# EAGLE design STM32L441CE (EAGLE 9.6.2)

## Sheet 1 of 2
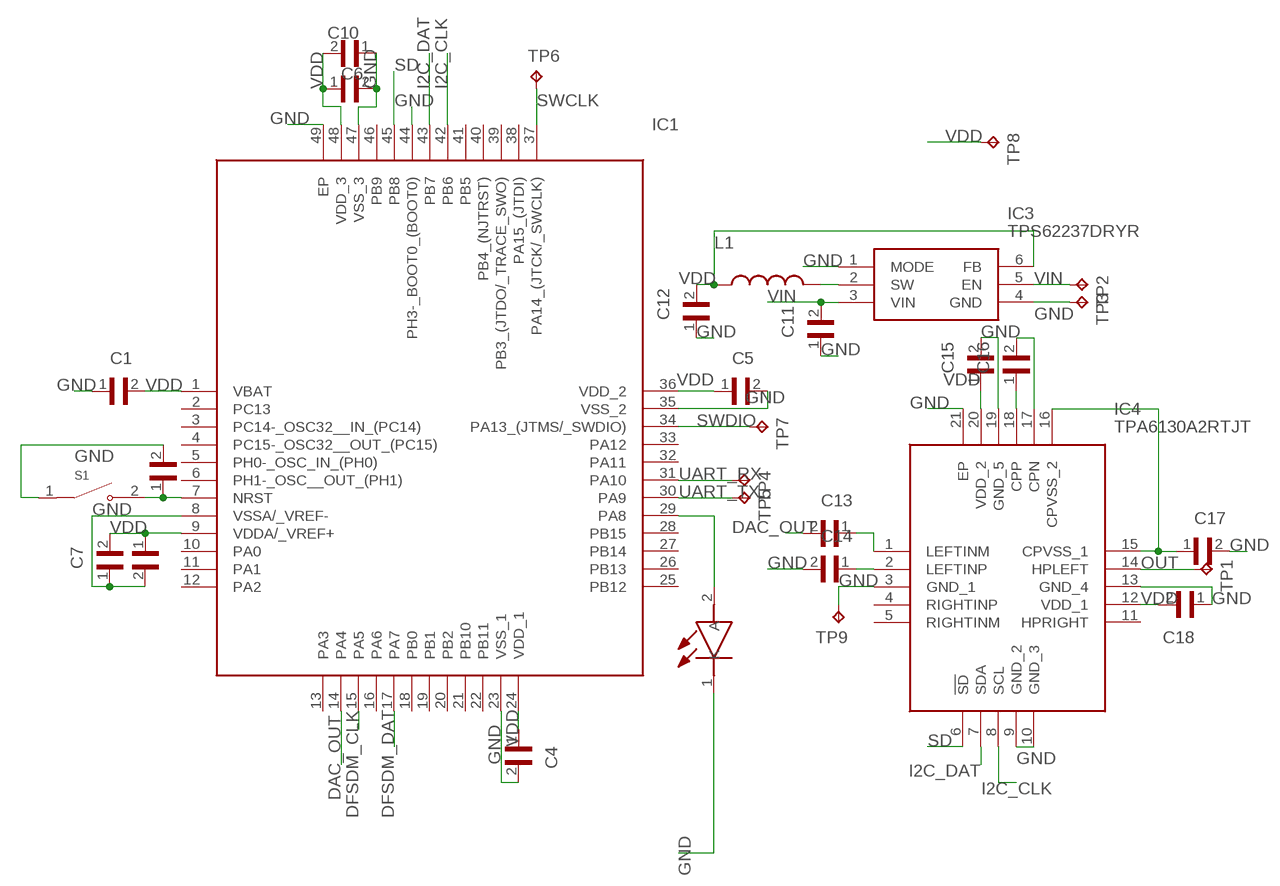
[diagram p0: schematic, sheet 1]

### Parts
C1  GRM033C80J104KE15D  [CAPC0603X33N]
C2  GRM033C80J104KE15D  [CAPC0603X33N]
C3  GRM033C80J104KE15D  [CAPC0603X33N]
C4  GRM033C80J104KE15D  [CAPC0603X33N]
C5  GRM033C80J104KE15D  [CAPC0603X33N]
C6  GRM033C80J104KE15D  [CAPC0603X33N]
C7  JMK105C6105KV-F  [CAPC1005X55N]
C10  GRM155R60J475ME47D  [CAPC1005X60N]
C11  GRM155R60J225KE95D  [CAPC1005X55N]
C12  GRM155R60J475ME47D  [CAPC1005X60N]
C13  CC0402KRX5R5BB474  [CAPC1005X55N]
C14  CC0402KRX5R5BB474  [CAPC1005X55N]
C15  JMK105C6105KV-F  [CAPC1005X55N]
C16  JMK105C6105KV-F  [CAPC1005X55N]
C17  JMK105C6105KV-F  [CAPC1005X55N]
C18  JMK105C6105KV-F  [CAPC1005X55N]
IC1  STM32L451CEU6  [QFN50P700X700X60-49N]
IC3  TPS62237DRYR  [SON50P100X145X60-6N]
IC4  TPA6130A2RTJT  [QFN50P400X400X80-21N]
L1  LQM21PN2R2MC0D  [INDC2012X55N]
LED1  VLMS1500-GS08  [VLMG1500GS08]
S1  B3U-1000P  [SW_B3U-1000P]
TP1  TPTP11R  [TP11R]
TP2  TPTP11R  [TP11R]
TP3  TPTP11R  [TP11R]
TP4  TPTP11R  [TP11R]
TP5  TPTP11R  [TP11R]
TP6  TPTP11R  [TP11R]
TP7  TPTP11R  [TP11R]
TP8  TPTP11R  [TP11R]
TP9  TPTP11R  [TP11R]

### Nets
DAC_OUT: C13.2 IC1.14(PA4)
DFSDM_CLK: IC1.15(PA5) ; also sheet 2
DFSDM_DAT: IC1.17(PA7) ; also sheet 2
GND: C1.1 C2.2 C3.2 C4.2 C5.2 C6.2 C7.1 C10.1 C11.1 C12.1 C14.2 C15.2 C17.2 C18.1 IC1.8(VSSA/_VREF-) IC1.23(VSS_1) IC1.35(VSS_2) IC1.44(PH3-_BOOT0_(BOOT0)) IC1.47(VSS_3) IC1.49(EP) IC3.1(MODE) IC3.4(GND) IC4.3(GND_1) IC4.9(GND_2) IC4.10(GND_3) IC4.13(GND_4) IC4.19(GND_5) IC4.21(EP) LED1.1(K) S1.1 TP3.TP TP9.TP ; also sheet 2
I2C_CLK: IC1.42(PB6) IC4.8(SCL)
I2C_DAT: IC1.43(PB7) IC4.7(SDA)
N$1: C2.1 IC1.7(NRST) S1.2
N$2: IC3.2(SW) L1.2
N$3: C13.1 IC4.1(LEFTINM)
N$4: C14.1 IC4.2(LEFTINP)
N$5: IC1.29(PA8) LED1.2(A)
N$6: C16.1 IC4.18(CPP)
N$7: C16.2 IC4.17(CPN)
N$8: C17.1 IC4.15(CPVSS_1) IC4.16(CPVSS_2)
OUT: IC4.14(HPLEFT) TP1.TP
SD: IC1.45(PB8) IC4.6(!SD)
SWCLK: IC1.37(PA14_(JTCK/_SWCLK)) TP6.TP
SWDIO: IC1.34(PA13_(JTMS/_SWDIO)) TP7.TP
UART_RX: IC1.31(PA10) TP4.TP
UART_TX: IC1.30(PA9) TP5.TP
VDD: C1.2 C3.1 C4.1 C5.1 C6.1 C7.2 C10.2 C12.2 C15.1 C18.2 IC1.1(VBAT) IC1.9(VDDA/_VREF+) IC1.24(VDD_1) IC1.36(VDD_2) IC1.48(VDD_3) IC3.6(FB) IC4.12(VDD_1) IC4.20(VDD_2) L1.1 TP8.TP ; also sheet 2
VIN: C11.2 IC3.3(VIN) IC3.5(EN) TP2.TP
Unconnected: IC1.2(PC13) IC1.3(PC14-_OSC32__IN_(PC14)) IC1.4(PC15-_OSC32__OUT_(PC15)) IC1.5(PH0-_OSC_IN_(PH0)) IC1.6(PH1-_OSC__OUT_(PH1)) IC1.10(PA0) IC1.11(PA1) IC1.12(PA2) IC1.13(PA3) IC1.16(PA6) IC1.18(PB0) IC1.19(PB1) IC1.20(PB2) IC1.21(PB10) IC1.22(PB11) IC1.25(PB12) IC1.26(PB13) IC1.27(PB14) IC1.28(PB15) IC1.32(PA11) IC1.33(PA12) IC1.38(PA15_(JTDI)) IC1.39(PB3_(JTDO/_TRACE_SWO)) IC1.40(PB4_(NJTRST)) IC1.41(PB5) IC1.46(PB9) IC4.4(RIGHTINP) IC4.5(RIGHTINM) IC4.11(HPRIGHT)

## Sheet 2 of 2
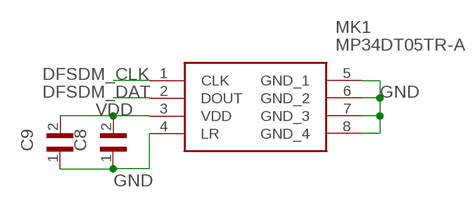
[diagram p1: schematic, sheet 2]

### Parts
C8  JMK105C6105KV-F  [CAPC1005X55N]
C9  GRM033C80J104KE15D  [CAPC0603X33N]
MK1  MP34DT05TR-A  [MP34DT05TRA]

### Nets
DFSDM_CLK: MK1.1(CLK) ; also sheet 1
DFSDM_DAT: MK1.2(DOUT) ; also sheet 1
GND: C8.1 C9.1 MK1.4(LR) MK1.5(GND_1) MK1.6(GND_2) MK1.7(GND_3) MK1.8(GND_4) ; also sheet 1
VDD: C8.2 C9.2 MK1.3(VDD) ; also sheet 1

## Library data of the parts
C1-C6 C9 = GRM033C80J104KE15D:GRM033C80J104KE15D: .1UF 6.3V 10% 0201; DESCRIPTION: SMD Capacitor X6S(EIA) with Capacitance: 0.10uF Tol. 10%. Rated Voltage: 6.3Vdc; DIGI-KEY_PART_NUMBER: 490-10390-1-ND; DIGIKEY-PURCHASE-URL: https://snapeda.com/shop?store=DigiKey&id=1836969; MF: Murata Electronics; MP: GRM033C80J104KE15D; PACKAGE: 0603 Taiyo Yuden
C7 C8 C15-C18 = JMK105C6105KV-F:JMK105C6105KV-F: CAP CER 1UF 6.3V X6S 0402; DESCRIPTION: 1µF ±10% 6.3V Ceramic Capacitor X6S 0402 (1005 Metric); DIGI-KEY_PART_NUMBER: 587-3381-1-ND; MF: Taiyo Yuden; MP: JMK105C6105KV-F; PACKAGE: 1005 Taiyo Yuden
C10 C12 = GRM155R60J475ME47D:GRM155R60J475ME47D: Cap Ceramic 4.7uF 6.3V X5R 20% Pad SMD 0402 85°C T/R; DESCRIPTION: SMD Capacitor X5R(EIA) with Capacitance: 4.7uF Tol. 20%. Rated Voltage: 6.3Vdc; DIGI-KEY_PART_NUMBER: 490-5915-1-ND; MF: Murata; MP: GRM155R60J475ME47D; PACKAGE: 1005 Taiyo Yuden
C11 = GRM155R60J225KE95D:GRM155R60J225KE95D: CAP CER 2.2UF 6.3V X5R 0402; DESCRIPTION: 2.2µF ±10% 6.3V Ceramic Capacitor X5R 0402 (1005 Metric); DIGI-KEY_PART_NUMBER: 490-12532-1-ND; MF: Murata; MP: GRM155R60J225KE95D; PACKAGE: 1005 Taiyo Yuden
C13 C14 = CC0402KRX5R5BB474:CC0402KRX5R5BB474: 0402 0.47 uF 6.3 V ±10 % Tolerance X5R SMT Multilayer Ceramic Capacitor; DESCRIPTION: 0.47µF ±10% 6.3V Ceramic Capacitor X5R 0402 (1005 Metric); DIGI-KEY_PART_NUMBER: 311-1684-1-ND; MF: Yageo; MP: CC0402KRX5R5BB474; PACKAGE: 0402 Yageo
IC1 = STM32L451CEU6:STM32L451CEU6: MCU 32-bit ARM Cortex M4 RISC 512KB Flash 3.3V 48-Pin UFQFPN Tray Source: Datasheet <https://www.arrow.com/en/products/stm32l451ceu6/stmicroelectronics>; ARROW_PART_NUMBER: STM32L451CEU6; ARROW_PRICE-STOCK: https://www.arrow.com/en/products/stm32l451ceu6/stmicroelectronics; DESCRIPTION: MCU 32-bit ARM Cortex M4 RISC 512KB Flash 3.3V 48-Pin UFQFPN Tray; HEIGHT: 0.6mm; MANUFACTURER_NAME: STMicroelectronics; MANUFACTURER_PART_NUMBER: STM32L451CEU6; MOUSER_PART_NUMBER: 511-STM32L451CEU6; MOUSER_PRICE-STOCK: https://www.mouser.com/Search/Refine.aspx?Keyword=511-STM32L451CEU6
IC3 = TPS62237DRYR:TPS62237DRYR: 2 MHz Ultra Small Step Down Converter with DCS-Control in 1x1.5 SON Package Source: Datasheet <http://www.ti.com/lit/gpn/TPS62230>; ARROW_PART_NUMBER: TPS62237DRYR; ARROW_PRICE-STOCK: https://www.arrow.com/en/products/tps62237dryr/texas-instruments; DESCRIPTION: 2 MHz Ultra Small Step Down Converter with DCS-Control in 1x1.5 SON Package; HEIGHT: 0.6mm; MANUFACTURER_NAME: Texas Instruments; MANUFACTURER_PART_NUMBER: TPS62237DRYR; MOUSER_PART_NUMBER: 595-TPS62237DRYR; MOUSER_PRICE-STOCK: https://www.mouser.co.uk/ProductDetail/Texas-Instruments/TPS62237DRYR?qs=%2Fqzd9s%252BcLd6Amw0z%252Byi3sQ%3D%3D
IC4 = TPA6130A2RTJT:TPA6130A2RTJT: Texas Instruments TPA6130A2RTJT Headphone Audio Amplifier, Class-AB Mono/Stereo 68dB, 20-Pin QFN Source: Datasheet <http://www.ti.com/lit/ds/symlink/tpa6130a2.pdf>; ARROW_PART_NUMBER: TPA6130A2RTJT; ARROW_PRICE-STOCK: https://www.arrow.com/en/products/tpa6130a2rtjt/texas-instruments; DESCRIPTION: Texas Instruments TPA6130A2RTJT Headphone Audio Amplifier, Class-AB Mono/Stereo 68dB, 20-Pin QFN; HEIGHT: 0.8mm; MANUFACTURER_NAME: Texas Instruments; MANUFACTURER_PART_NUMBER: TPA6130A2RTJT; MOUSER_PART_NUMBER: 595-TPA6130A2RTJT; MOUSER_PRICE-STOCK: https://www.mouser.co.uk/ProductDetail/Texas-Instruments/TPA6130A2RTJT?qs=7kv20MEVUlhbnsEmMhzkWg%3D%3D
L1 = LQM21PN2R2MC0D:LQM21PN2R2MC0D: INDUCTOR, 2.2UH, 20%, 0.6A, 50MHZ, 0805; DESCRIPTION: Inductor with Inductance: 2.2uH Tol. +/-20%, Package: 0805 (2012); DIGI-KEY_PART_NUMBER: 490-4994-1-ND; DIGIKEY-PURCHASE-URL: https://snapeda.com/shop?store=DigiKey&id=1501934; MF: Murata; MOUSER-PURCHASE-URL: https://snapeda.com/shop?store=Mouser&id=1501934; MP: LQM21PN2R2MC0D; PACKAGE: 2012 Murata
LED1 = VLMS1500-GS08:VLMS1500-GS08: Vishay 631 nm Red LED, 1005 (0402) SMD package Source: Datasheet <https://componentsearchengine.com/Datasheets/2/VLMS1500-GS08.pdf>; ARROW_PART_NUMBER: VLMS1500-GS08; ARROW_PRICE-STOCK: https://www.arrow.com/en/products/vlms1500-gs08/vishay; DESCRIPTION: Vishay 631 nm Red LED, 1005 (0402) SMD package; HEIGHT: mm; MANUFACTURER_NAME: Vishay; MANUFACTURER_PART_NUMBER: VLMS1500-GS08; MOUSER_PART_NUMBER: 78-VLMS1500-GS08; MOUSER_PRICE-STOCK: https://www.mouser.co.uk/ProductDetail/Vishay-Semiconductors/VLMS1500-GS08?qs=2BArZ0I3QllOybMBfd%252BobQ%3D%3D
MK1 = MP34DT05TR-A:MP34DT05TR-A: STMICROELECTRONICS - MP34DT05TR-A - MEMS MICROPHONE, 3.6V, HCLGA-4 Source: Datasheet <http://www.st.com/content/ccc/resource/technical/document/datasheet/group3/c7/90/d3/f6/b7/e7/40/c8/DM00415595/files/DM00415595.pdf/jcr:content/translations/en.DM00415595.pdf>; DESCRIPTION: STMICROELECTRONICS - MP34DT05TR-A - MEMS MICROPHONE, 3.6V, HCLGA-4; HEIGHT: 1mm; MANUFACTURER_NAME: STMicroelectronics; MANUFACTURER_PART_NUMBER: MP34DT05TR-A; MOUSER_PART_NUMBER: 511-MP34DT05TR-A; MOUSER_PRICE-STOCK: https://www.mouser.com/Search/Refine.aspx?Keyword=511-MP34DT05TR-A
S1 = B3U-1000P:B3U-1000P: Switch Tactile N.O. SPST Round Button Gull Wing 0.05A 12VDC 1.5N SMD Embossed T/R; DESCRIPTION: Tactile Switch SPST-NO Top Actuated Surface Mount; DIGI-KEY_PART_NUMBER: SW1020CT-ND; DIGIKEY-PURCHASE-URL: https://snapeda.com/shop?store=DigiKey&id=104326; MF: Omron; MP: B3U-1000P; PACKAGE: None
TP1-TP9 = testpad:TP: Test pad

## Board
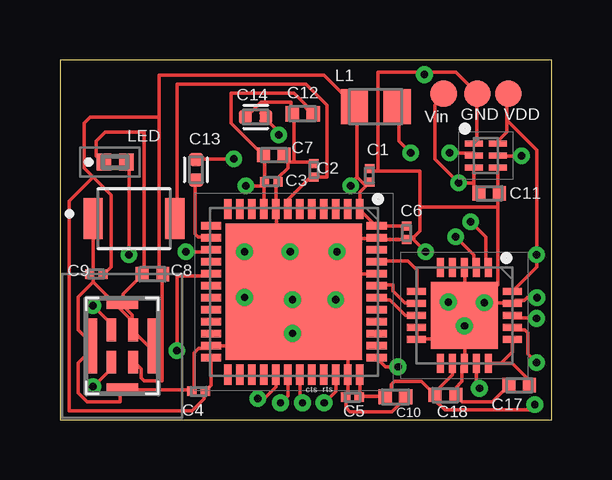
[diagram p2: board, top side]
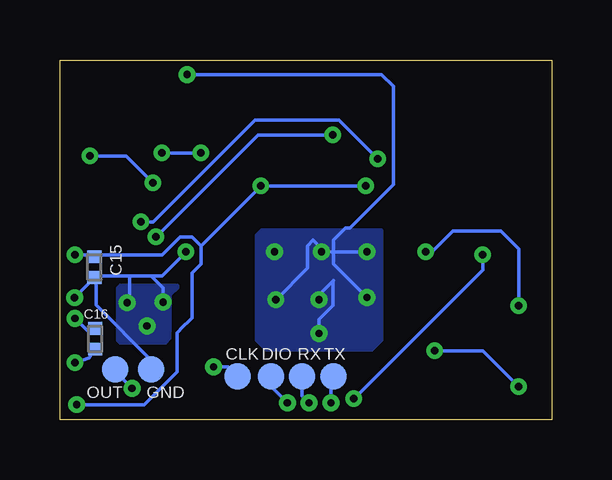
[diagram p3: board, bottom side, seen from below]

Size 20.5 x 15 mm. Coordinates in mm from the lower left corner, seen from the top.
Outline: 0,0 20.5,0 20.5,15 0,15 0,0
Copper layers (1*16): Top 0.035mm / dielectric 1.5mm / Bottom 0.035mm
Design rules "default *": minimum track width 6mil, minimum drill 0.3mm, track to track 6mil, track to pad 6mil, pad to pad 6mil, via to via 6mil, smd to smd 6mil, copper to edge 10mil, drill to drill 0.3mm, minimum pad ring 10mil, minimum via ring 8mil, stop-mask expansion 4mil, vias tented up to drill 0mil, thermal gap 10mil

### Footprints (pad centres in the part's own frame; a part is rotated, then mirrored left to right if it is on the bottom)
CAPC0603X33N = smd 0.38 x 0.4: 1 -0.281,0; 2 0.281,0
CAPC1005X55N = smd 0.54 x 0.6: 1 -0.432,0; 2 0.432,0
CAPC1005X60N = smd 0.56 x 0.63: 1 -0.435,0; 2 0.435,0
CAPC1005X55N' = smd 0.54 x 0.6: 1 -0.43,0; 2 0.43,0
QFN50P700X700X60-49N = smd 0.85 x 0.3: 1 -3.45,2.75; 2 -3.45,2.25; 3 -3.45,1.75; 4 -3.45,1.25; 5 -3.45,0.75; 6 -3.45,0.25; 7 -3.45,-0.25; 8 -3.45,-0.75; 9 -3.45,-1.25; 10 -3.45,-1.75; 11 -3.45,-2.25; 12 -3.45,-2.75; 25 3.45,-2.75; 26 3.45,-2.25; 27 3.45,-1.75; 28 3.45,-1.25; 29 3.45,-0.75; 30 3.45,-0.25; 31 3.45,0.25; 32 3.45,0.75; 33 3.45,1.25; 34 3.45,1.75; 35 3.45,2.25; 36 3.45,2.75 | smd 0.3 x 0.85: 13 -2.75,-3.45; 14 -2.25,-3.45; 15 -1.75,-3.45; 16 -1.25,-3.45; 17 -0.75,-3.45; 18 -0.25,-3.45; 19 0.25,-3.45; 20 0.75,-3.45; 21 1.25,-3.45; 22 1.75,-3.45; 23 2.25,-3.45; 24 2.75,-3.45; 37 2.75,3.45; 38 2.25,3.45; 39 1.75,3.45; 40 1.25,3.45; 41 0.75,3.45; 42 0.25,3.45; 43 -0.25,3.45; 44 -0.75,3.45; 45 -1.25,3.45; 46 -1.75,3.45; 47 -2.25,3.45; 48 -2.75,3.45 | smd 5.7 x 5.7: 49 0,0
SON50P100X145X60-6N = smd 0.75 x 0.25: 1 -0.5,0.5; 2 -0.5,0; 3 -0.5,-0.5; 4 0.5,-0.5; 5 0.5,0; 6 0.5,0.5
QFN50P400X400X80-21N = smd 0.8 x 0.3: 1 -2,1; 2 -2,0.5; 3 -2,0; 4 -2,-0.5; 5 -2,-1; 11 2,-1; 12 2,-0.5; 13 2,0; 14 2,0.5; 15 2,1 | smd 0.3 x 0.8: 6 -1,-2; 7 -0.5,-2; 8 0,-2; 9 0.5,-2; 10 1,-2; 16 1,2; 17 0.5,2; 18 0,2; 19 -0.5,2; 20 -1,2 | smd 2.8 x 2.8: 21 0,0
INDC2012X55N = smd 1.14 x 1.47: 1 -0.89,0; 2 0.89,0
VLMG1500GS08 = smd 0.6 x 0.7: 1 -0.475,0; 2 0.475,0
MP34DT05TRA = smd 0.4 x 0.95: 1 -0.45,0.675; 2 -0.45,-0.675; 3 0.45,-0.675; 4 0.45,0.675 | smd 0.35 x 2.3: 5 -1.225,0; 6 1.225,0 | smd 1.3 x 0.35: 7 0,1.725; 8 0,-1.725
SW_B3U-1000P = smd 0.8 x 1.7: 1 -1.7,0; 2 1.7,0
TP11R = smd 1.1 x 1.1: TP 0,0

### Placement (x,y rotation side)
C1  12.91,10.19 270 top
C2  10.58,10.4 90 top
C3  8.81,9.92 0 top
C4  5.78,1.18 180 top
C5  12.2,0.94 180 top
C6  14.46,7.79 270 top
C7  8.92,11.04 180 top
C8  3.86,6.06 0 top
C9  1.52,6.06 0 top
C10  13.99,0.95 180 top
C11  17.9,9.44 180 top
C12  10.12,12.75 0 top
C13  CC0402KRX5R5BB474  [CAPC1005X55N']  5.67,10.42 270 top
C14  CC0402KRX5R5BB474  [CAPC1005X55N']  8.16,12.62 180 top
C15  19.06,6.36 270 bottom
C16  19.03,3.37 270 bottom
C17  19.15,1.43 180 top
C18  16.07,1.03 180 top
IC1  9.75,5.33 270 top
IC3  17.75,11.01 0 top
IC4  16.87,4.34 270 top
L1  13.17,13.05 0 top
LED1  2.3,10.74 0 top
MK1  2.6,3.07 0 top
S1  3.09,8.38 0 top
TP1  18.2,2.1 0 bottom
TP2  16,13.6 0 top
TP3  16.7,2.1 0 bottom
TP4  10.4,1.8 0 bottom
TP5  9.1,1.8 0 bottom
TP6  13.1,1.8 0 bottom
TP7  11.7,1.8 0 bottom
TP8  18.7,13.6 0 top
TP9  17.4,13.6 0 top

### Tracks (layer width: path | path; a pad name or v marks a point on that pad's centre or on a via)
DAC_OUT
  Top 0.152: C13.2 5.62,9.88 5.62,7.75 5.75,7.62 6.25,7.62 IC1.14
DFSDM_CLK  (via drill 0.3)
  Top 0.152: v5.25,7 6.25,7 IC1.15 | v1.38,4.75 2.12,4 2.12,3.75 MK1.1
  Bottom 0.152: v5.25,7 5,7 4.12,7.88 2.12,7.88 1.38,7.12 v1.38,4.75
DFSDM_DAT  (via drill 0.3)
  Top 0.152: v4.88,2.88 4.88,6 6.25,6 IC1.17 | v1.38,1.38 2.12,2.12 2.12,2.38 MK1.2
  Bottom 0.152: v4.88,2.88 2.88,2.88 v1.38,1.38
GND  (via drill 0.3)
  Top 0.152: C10.1 14.43,0.9 13.85,0.33 12.1,0.33 11.92,0.51 C5.2 12,1.02 IC1.35 12,3.08 IC1.49 | IC3.4 18.25,9.52 C11.1 18.25,9.38 18.25,8.88 | 9.5,10.75 9.5,10.5 9.09,10.09 C3.2 9,9.83 IC1.8 9.02,8.76 9.02,8.06 9.62,7.46 | 9.5,10.75 9.5,10.89 C7.1 9.5,10.75 | IC1.44 10.5,6.08 | 11.51,6.89 12.18,7.56 13.18,7.56 IC1.47 13.27,7.51 C6.2 14.5,7.62 14.75,7.62 | v11.55,7 10.08,7 9.62,7.46 | v11.55,7 11.55,7.4 9.75,5.6 | 9.75,5.6 7.23,3.08 IC1.23 6.18,2.96 5.78,2.96 5.6,2.78 5.6,1.28 C4.2 5.38,1.25 2.62,1.25 MK1.8 2.5,1.25 2.5,0.75 1.12,0.75 0.75,1.12 0.75,2.38 1.38,3 MK1.5 1.38,3.12 0.75,3.75 0.75,5.12 1.38,5.75 | S1.1 1.38,8.38 1.38,6.25 1.25,6.12 C9.1 1.25,6 1.38,5.88 1.38,5.75 | MK1.4 3.12,3.62 3.75,3 MK1.6 | 3,4.12 3,3.75 MK1.4 | 3,4.12 3,4.38 2.62,4.75 MK1.7 2.62,4.88 2.62,5.25 3.38,6 C8.1 3.5,6.12 3.5,12 1.89,12 1.5,11.61 1.5,11 1.75,10.75 LED1.1 | 3,4.12 1.38,5.75 | 3,4.12 MK1.4 | 14.88,3.38 14.88,3.75 IC4.9 | C17.2 18.04,0.75 16.78,0.75 C18.1 16.5,1.33 16.77,1.6 16.77,2.24 IC4.13 16.88,2.38 16.88,3.38 | 16.88,4.88 16.88,4.38 IC4.21 | 16.88,4.88 16.88,6.25 IC4.3 | 16.88,4.88 v17.7,4.88 | v17.7,4.88 18.12,4.88 | 18.12,4.88 18.75,4.88 IC4.19 18.99,4.96 19.36,4.96 19.49,5.08 v19.89,5.08 | 16.88,4.88 IC4.21 | 16.88,3.38 16.88,4.25 IC4.21 | 16.88,3.38 14.88,3.38 | 14.88,3.38 IC4.10 | 16.88,3.38 v16.87,3.9 IC4.21 | 18.25,8.88 18.25,5.62 18.12,5.5 18.12,4.88 | 18.12,4.88 IC4.21 | IC3.1 17.25,11.62 17.38,11.75 17.38,13.5 TP9.TP 16.5,14.5 15.2,14.5 | C14.2 7.75,12.62 8.38,13.25 9.62,13.25 9.62,12.75 C12.1 9.75,12.75 9.75,10.75 | 9.5,10.75 9.75,10.75 | 9.75,10.75 10.5,10.75 C2.2 | 13.25,10.38 15,10.38 15,8.88
  Top 0.152: 13.25,10.38 13,10.38 C1.1 | 15,8.88 15,7.88 14.75,7.62 | 15.2,14.5 13.25,14.5 13.25,10.38 | v15.25,7 14.75,7.5 14.75,7.62 | 15,8.88 18.25,8.88 | v15.2,14.39 15.2,14.5 | v11.55,7 11.42,7 10.5,6.08 | IC1.49 9.75,5.05 v9.7,5 | IC1.49 9.37,5.33 v7.7,7 | IC1.49 7.93,5.33 v7.7,5.1 | IC4.21 17.41,4.88 v17.7,4.88 | IC4.21 16.31,4.9 v16.2,4.9 | IC1.49 9.75,5.6 | IC1.49 10.5,6.08 | v9.6,7 9.6,7.44 9.62,7.46
  Bottom 0.152: TP3.TP 16.7,2.48 19,4.78 19,5.88 C15.2 | 16.7,6 16.25,6 v15.25,7 | 16.7,6 17.6,6 | 17.6,6 19,6 C15.2 | v19.89,5.08 19.89,5.09 C15.2 | v15.2,14.39 7.09,14.39 6.6,13.9 6.6,9.8 8.4,8 8.6,8 9.1,7.5 9.1,6.5 v7.7,5.1 | v7.7,7 v9.6,7 9.6,7.14 9.94,7.48 10.18,7.24 10.18,6.32 v11.5,5 | v17.7,4.88 17.6,4.97 17.6,6 | v16.2,4.9 16.2,5.5 16.7,6 | v9.7,3.6 9.7,4.18 9.12,4.76 9.12,5.78 | 9.12,5.78 9.1,5.8 | 9.12,5.78 9.7,5.2 v9.7,5
  pour Bottom: 7.1,7.9 12.1,7.9 12.3,7.7 12.3,4.9 12.3,4.1 12.3,3.3 11.9,2.9 7.5,2.9 7.1,3.3
  pour Bottom: 15.6,5.6 18,5.6 18.1,5.5 18.1,3.3 18,3.2 16.1,3.2 15.9,3.4 15.9,5.2 15.6,5.5
I2C_CLK
  Top 0.152: IC4.8 14.41,4.34 13.75,5 13.25,5 IC1.42
I2C_DAT
  Top 0.152: IC1.43 13.25,5.62 13.88,5.62 13.88,5.38 14.38,4.88 14.75,4.88 IC4.7
N$1
  Top 0.152: IC1.7 9.5,9.18 10.44,10.12 C2.1 10.62,10.12 11.12,10.12 11.12,13.12 10.25,14 4.88,14 4.88,8.5 S1.2
N$2  (via drill 0.3)
  Top 0.152: v16.25,11.12 17.25,11.12 IC3.2 | v14.62,11.12 14.12,11.62 14.12,13 L1.2
  Bottom 0.152: v14.62,11.12 v16.25,11.12
N$3  (via drill 0.3)
  Top 0.152: v7.25,10.88 5.75,10.88 C13.1 | v17.12,8.25 17.75,7.62 17.75,6.38 IC4.1
  Bottom 0.152: v7.25,10.88 8.88,12.5 12.38,12.5 16.62,8.25 v17.12,8.25
N$4  (via drill 0.3)
  Top 0.152: v9.12,11.88 9.12,12 8.62,12.5 C14.1 | v16.5,7.62 17.25,6.88 17.25,6.38 IC4.2
  Bottom 0.152: v9.12,11.88 12.25,11.88 v16.5,7.62
N$5  (via drill 0.3)
  Top 0.152: v2.88,6.88 2.88,10.62 LED1.2 | v8.25,0.88 8.5,0.88 9,1.38 IC1.29
  Bottom 0.152: v2.88,6.88 2.88,6.25 v8.25,0.88
N$6  (via drill 0.3)
  Top 0.152: v19.88,4.22 19.85,4.25 18.88,4.25 IC4.18
  Bottom 0.152: v19.88,4.22 19.29,3.64 C16.1
N$7  (via drill 0.3)
  Top 0.152: v19.88,2.38 19.5,2.75 19.5,3.62 19.38,3.75 18.88,3.75 IC4.17
  Bottom 0.152: v19.88,2.38 19.29,2.58 C16.2
N$8
  Top 0.152: IC4.16 18.87,2.8 18.85,2.8 18.39,2.34 IC4.15 18.87,2.34 19.58,1.63 C17.1
OUT  (via drill 0.3)
  Top 0.152: IC4.14 17.37,1.43 v17.5,1.3
  Bottom 0.152: TP1.TP 18.2,2.01 v17.5,1.3
SD
  Top 0.152: IC4.6 14.88,5.38 14.88,6.25 14.5,6.62 13.25,6.62 IC1.45
SWCLK  (via drill 0.3)
  Top 0.152: IC1.37 13.58,2.2 v14.1,2.2
  Bottom 0.152: v14.1,2.2 13.5,2.2 TP6.TP
SWDIO  (via drill 0.3)
  Top 0.152: IC1.34 11.5,1.18 v11.02,0.7
  Bottom 0.152: v11.02,0.7 11.7,1.38 TP7.TP
UART_RX  (via drill 0.3)
  Top 0.152: 10.1,1.78 IC1.31 10,0.81 v10.11,0.7
  Bottom 0.152: TP4.TP 10.4,0.99 v10.11,0.7
UART_TX  (via drill 0.3)
  Top 0.152: IC1.30 9.5,1 v9.2,0.7
  Bottom 0.152: v9.2,0.7 9.2,1.7 TP5.TP
VDD  (via drill 0.3)
  Top 0.152: IC1.36 12.5,0.96 | 12.5,0.96 C5.1 | 12.5,0.96 C10.2 13.82,1.21 13.82,1.46 13.95,1.59 15.07,1.59 C18.2 | IC4.12 16.37,1.87 15.64,1.14 C18.2 | IC1.9 8.5,9.75 | 8.5,9.75 8.5,9.89 C3.1 | C3.1 8.53,11 C7.2 8.38,11.12 7.12,12.38 7.12,13.62 9.75,13.62 10.25,13.12 10.25,13 10.5,12.75 C12.2 | C6.1 IC1.48 13.12,8.12 12.5,8.75 IC1.1 12.5,9.5 C1.2 12.75,9.75 12.38,10.12 | IC1.24 6.3,1.42 C4.1 6,1.12 6,0.88 5.5,0.38 0.38,0.38 0.38,9.12 1.38,10.12 | 12.38,10.12 12.38,13 L1.1 12.25,13.12 11,14.38 4.12,14.38 4.12,12.62 | 1.38,10.12 1,10.5 1,12.38 1.25,12.62 4.12,12.62 | 1.38,10.12 2.12,9.38 2.12,6.38 1.88,6.12 C9.2 | 4.12,12.62 4.12,6.25 4.25,6.12 C8.2 4.25,6 4.25,1.62 3.5,1.62 3.38,1.75 3.38,2.12 3.12,2.38 MK1.3 | 18.62,12.5 18.62,13.5 TP8.TP | 18.62,12.5 18.62,12 18.25,11.62 IC3.6 | 18.62,12.5 19.88,11.25 v19.88,6.88 19.88,6.38 18.88,5.38 IC4.20 | C18.2 15.64,0.81 16.05,0.4 19.8,0.4 v19.8,0.62 | v7.75,9.75 8.5,9.75 | 8.5,9.75 C3.1 | 12.38,10.12 12.12,9.88 v12.12,9.75
  Bottom 0.152: 14.62,7.25 15,7.62 15.5,7.62 16.25,6.88 19,6.88 C15.1 19.12,6.88 v19.88,6.88 | 14.62,7.25 14.62,6.5 15,6.12 15,4.57 15,4.25 15.12,4.12 15.36,3.89 15.62,3.62 15.62,2 17,0.62 v19.8,0.62 | v7.75,9.75 v12.12,9.75 14.62,7.25
VIN  (via drill 0.3)
  Top 0.152: IC3.3 17.25,9.88 | 17.25,9.88 17.25,9.66 C11.2 | v19.25,11 IC3.5 | 17.25,9.88 v16.62,9.88 15.62,10.88 15.62,13.12 16,13.5 TP2.TP
  Bottom 0.152: v19.25,11 17.75,11 v16.62,9.88

### Text on the board
tNames: LED | Vin | GND | VDD | cts | rts
bNames: TX | RX | DIO | CLK | GND | OUT